# EAGLE design sparkpunk_sequencer (EAGLE 6.5.0)
PROD_ID: DIO-11895
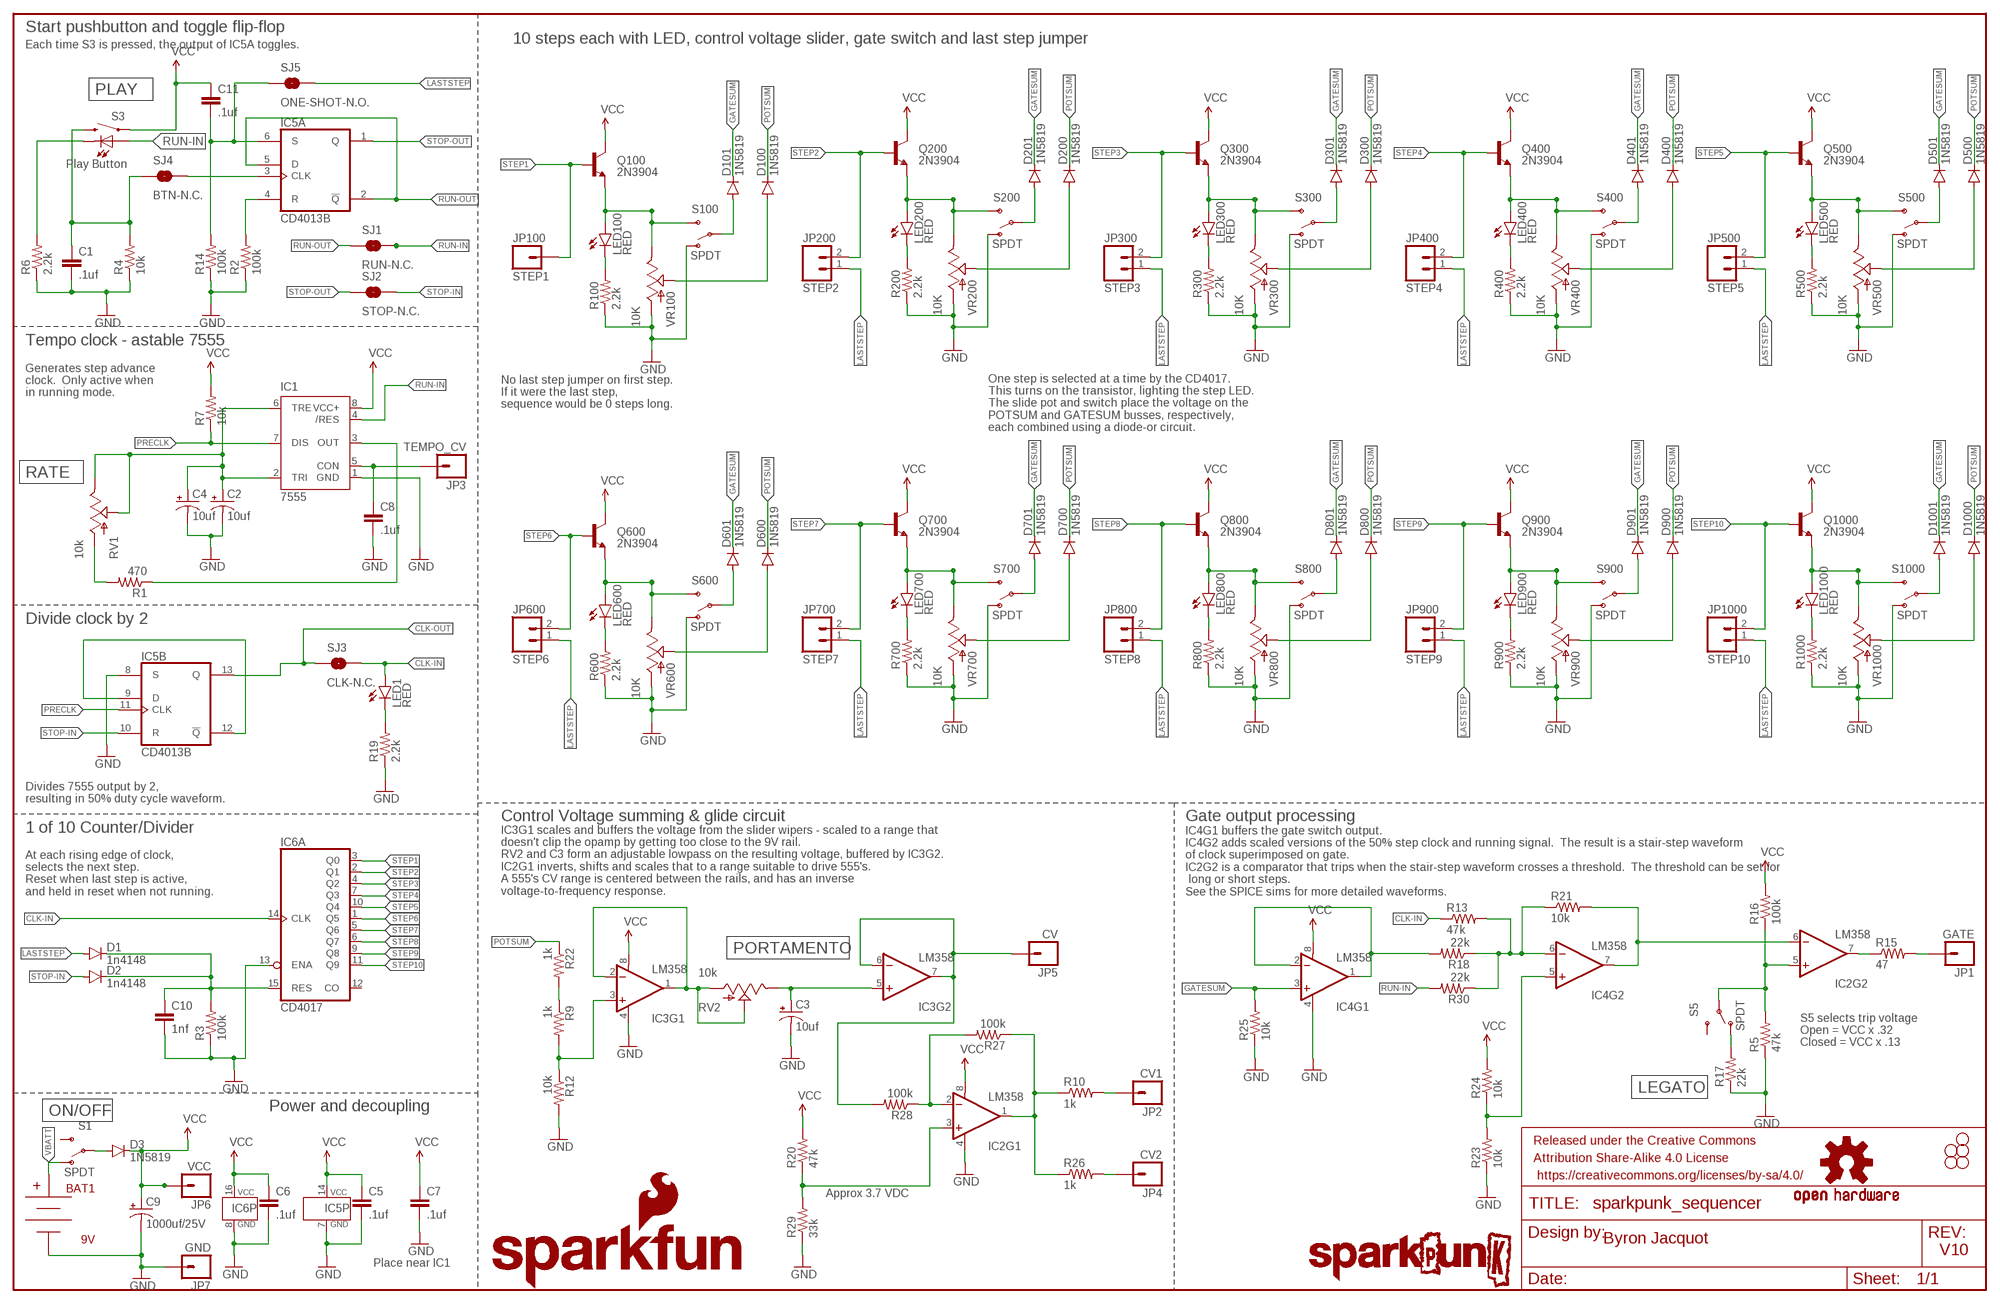
[diagram p0: schematic, sheet 1]

## Parts
BAT1  9V  BC9VPCKIT_SOLDERMASK  [BC9VPC_KIT]
C1  .1uf  0.1UF-50V-20%(PTH)KIT-EZ  [CAP-PTH-SMALL-KIT]
C2  10uf  10UF-25V-20%(PTH)KIT  [CPOL-RADIAL-10UF-25V-KIT]
C3  10uf  10UF-25V-20%(PTH)KIT  [CPOL-RADIAL-10UF-25V-KIT]
C4  10uf  10UF-25V-20%(PTH)KIT  [CPOL-RADIAL-10UF-25V-KIT]
C5  .1uf  0.1UF-50V-20%(PTH)KIT-EZ  [CAP-PTH-SMALL-KIT]
C6  .1uf  0.1UF-50V-20%(PTH)KIT-EZ  [CAP-PTH-SMALL-KIT]
C7  .1uf  0.1UF-50V-20%(PTH)KIT-EZ  [CAP-PTH-SMALL-KIT]
C8  .1uf  0.1UF-50V-20%(PTH)KIT-EZ  [CAP-PTH-SMALL-KIT]
C9  1000uf/25V  1000UF-25V(PTH)KIT  [CPOL-RADIAL-1000UF-25V-KIT]
C10  1nf  CAPKIT  [CAP-PTH-SMALL-KIT]
C11  .1uf  0.1UF-50V-20%(PTH)KIT-EZ  [CAP-PTH-SMALL-KIT]
D1  1n4148  DIODEKIT  [DIODE-1N4148-KIT]
D2  1n4148  DIODEKIT  [DIODE-1N4148-KIT]
D3  1N5819  DIODE  [DIODE-1N4001-KIT]
D100  1N5819  DIODE  [DIODE-1N4001-KIT]
D101  1N5819  DIODE  [DIODE-1N4001-KIT]
D200  1N5819  DIODE  [DIODE-1N4001-KIT]
D201  1N5819  DIODE  [DIODE-1N4001-KIT]
D300  1N5819  DIODE  [DIODE-1N4001-KIT]
D301  1N5819  DIODE  [DIODE-1N4001-KIT]
D400  1N5819  DIODE  [DIODE-1N4001-KIT]
D401  1N5819  DIODE  [DIODE-1N4001-KIT]
D500  1N5819  DIODE  [DIODE-1N4001-KIT]
D501  1N5819  DIODE  [DIODE-1N4001-KIT]
D600  1N5819  DIODE  [DIODE-1N4001-KIT]
D601  1N5819  DIODE  [DIODE-1N4001-KIT]
D700  1N5819  DIODE  [DIODE-1N4001-KIT]
D701  1N5819  DIODE  [DIODE-1N4001-KIT]
D800  1N5819  DIODE  [DIODE-1N4001-KIT]
D801  1N5819  DIODE  [DIODE-1N4001-KIT]
D900  1N5819  DIODE  [DIODE-1N4001-KIT]
D901  1N5819  DIODE  [DIODE-1N4001-KIT]
D1000  1N5819  DIODE  [DIODE-1N4001-KIT]
D1001  1N5819  DIODE  [DIODE-1N4001-KIT]
FRAME1  FRAME-LEDGER  [CREATIVE_COMMONS]
IC1  7555  NE555KIT  [DIP08-KIT]
IC2  LM358  LM358KIT  [DIP08-KIT]
IC3  LM358  LM358KIT  [DIP08-KIT]
IC4  LM358  LM358KIT  [DIP08-KIT]
IC5  CD4013B  CD4013  [DIL14-KIT]
IC6  CD4017  CD4017KIT  [DIL16-KIT]
JP1  GATE  M01SMDNS  [1X01NS]
JP2  CV1  M01SMDNS  [1X01NS]
JP3  TEMPO_CV  M01SMDNS  [1X01NS]
JP4  CV2  M01SMDNS  [1X01NS]
JP5  CV  M01SMDNS  [1X01NS]
JP6  VCC  M01SMDNS  [1X01NS]
JP7  GND  M01SMDNS  [1X01NS]
JP100  STEP1  M01SMDNS  [1X01NS]
JP200  STEP2  M021X02_NO_SILK  [1X02_NO_SILK]
JP300  STEP3  M021X02_NO_SILK  [1X02_NO_SILK]
JP400  STEP4  M021X02_NO_SILK  [1X02_NO_SILK]
JP500  STEP5  M021X02_NO_SILK  [1X02_NO_SILK]
JP600  STEP6  M021X02_NO_SILK  [1X02_NO_SILK]
JP700  STEP7  M021X02_NO_SILK  [1X02_NO_SILK]
JP800  STEP8  M021X02_NO_SILK  [1X02_NO_SILK]
JP900  STEP9  M021X02_NO_SILK  [1X02_NO_SILK]
JP1000  STEP10  M021X02_NO_SILK  [1X02_NO_SILK]
LED1  RED  LED5MM-KIT  [LED5MM-KIT]
LED100  RED  LED5MM-KIT  [LED5MM-KIT]
LED200  RED  LED5MM-KIT  [LED5MM-KIT]
LED300  RED  LED5MM-KIT  [LED5MM-KIT]
LED400  RED  LED5MM-KIT  [LED5MM-KIT]
LED500  RED  LED5MM-KIT  [LED5MM-KIT]
LED600  RED  LED5MM-KIT  [LED5MM-KIT]
LED700  RED  LED5MM-KIT  [LED5MM-KIT]
LED800  RED  LED5MM-KIT  [LED5MM-KIT]
LED900  RED  LED5MM-KIT  [LED5MM-KIT]
LED1000  RED  LED5MM-KIT  [LED5MM-KIT]
LOGO1  SPARKPUNK_LOGO.2_INCH_TALL  [SPARKPUNK_LOGO_.2]
LOGO2  OSHW-LOGOM  [OSHW-LOGO-M]
LOGO3  SPARKPUNK_LOGO.1INCH_TALL  [SPARKPUNK_LOGO_.1]
LOGO4  SFE_LOGO_NAME_FLAME.4_INCH  [SFE_LOGO_NAME_FLAME_.4]
Q100  2N3904  TRANSISTOR_NPNTO-92-AMMO  [TO-92-AMMO]
Q200  2N3904  TRANSISTOR_NPNTO-92-AMMO  [TO-92-AMMO]
Q300  2N3904  TRANSISTOR_NPNTO-92-AMMO  [TO-92-AMMO]
Q400  2N3904  TRANSISTOR_NPNTO-92-AMMO  [TO-92-AMMO]
Q500  2N3904  TRANSISTOR_NPNTO-92-AMMO  [TO-92-AMMO]
Q600  2N3904  TRANSISTOR_NPNTO-92-AMMO  [TO-92-AMMO]
Q700  2N3904  TRANSISTOR_NPNTO-92-AMMO  [TO-92-AMMO]
Q800  2N3904  TRANSISTOR_NPNTO-92-AMMO  [TO-92-AMMO]
Q900  2N3904  TRANSISTOR_NPNTO-92-AMMO  [TO-92-AMMO]
Q1000  2N3904  TRANSISTOR_NPNTO-92-AMMO  [TO-92-AMMO]
R1  470  RESISTOREZ  [AXIAL-0.3EZ]
R2  100k  RESISTOREZ  [AXIAL-0.3EZ]
R3  100k  RESISTOREZ  [AXIAL-0.3EZ]
R4  10k  RESISTOREZ  [AXIAL-0.3EZ]
R5  47k  RESISTOREZ  [AXIAL-0.3EZ]
R6  2.2k  RESISTOREZ  [AXIAL-0.3EZ]
R7  10k  RESISTOREZ  [AXIAL-0.3EZ]
R9  1k  RESISTOREZ  [AXIAL-0.3EZ]
R10  1k  RESISTOREZ  [AXIAL-0.3EZ]
R12  10k  RESISTOREZ  [AXIAL-0.3EZ]
R13  47k  RESISTOREZ  [AXIAL-0.3EZ]
R14  100k  RESISTOREZ  [AXIAL-0.3EZ]
R15  47  RESISTOREZ  [AXIAL-0.3EZ]
R16  100k  RESISTOREZ  [AXIAL-0.3EZ]
R17  22k  RESISTOREZ  [AXIAL-0.3EZ]
R18  22k  RESISTOREZ  [AXIAL-0.3EZ]
R19  2.2k  RESISTOREZ  [AXIAL-0.3EZ]
R20  47k  RESISTOREZ  [AXIAL-0.3EZ]
R21  10k  RESISTOREZ  [AXIAL-0.3EZ]
R22  1k  RESISTOREZ  [AXIAL-0.3EZ]
R23  10k  RESISTOREZ  [AXIAL-0.3EZ]
R24  10k  RESISTOREZ  [AXIAL-0.3EZ]
R25  10k  RESISTOREZ  [AXIAL-0.3EZ]
R26  1k  RESISTOREZ  [AXIAL-0.3EZ]
R27  100k  RESISTOREZ  [AXIAL-0.3EZ]
R28  100k  RESISTOREZ  [AXIAL-0.3EZ]
R29  33k  RESISTOREZ  [AXIAL-0.3EZ]
R30  22k  RESISTOREZ  [AXIAL-0.3EZ]
R100  2.2k  RESISTOREZ  [AXIAL-0.3EZ]
R200  2.2k  RESISTOREZ  [AXIAL-0.3EZ]
R300  2.2k  RESISTOREZ  [AXIAL-0.3EZ]
R400  2.2k  RESISTOREZ  [AXIAL-0.3EZ]
R500  2.2k  RESISTOREZ  [AXIAL-0.3EZ]
R600  2.2k  RESISTOREZ  [AXIAL-0.3EZ]
R700  2.2k  RESISTOREZ  [AXIAL-0.3EZ]
R800  2.2k  RESISTOREZ  [AXIAL-0.3EZ]
R900  2.2k  RESISTOREZ  [AXIAL-0.3EZ]
R1000  2.2k  RESISTOREZ  [AXIAL-0.3EZ]
RV1  10k  POTALPS-KIT  [ALPS_POT_KIT]
RV2  10k  POTALPS-KIT  [ALPS_POT_KIT]
S1  SPDT  SWITCH-SPDTKIT  [SWITCH-SPDT_KIT]
S3  Play Button  SWITCH-MOMENTARY-LEDEZ  [TACTILE-PTH-LED-12MM-EZ]
S5  SPDT  SWITCH-SPDTKIT  [SWITCH-SPDT_KIT]
S100  SPDT  SWITCH-SPDTKIT  [SWITCH-SPDT_KIT]
S200  SPDT  SWITCH-SPDTKIT  [SWITCH-SPDT_KIT]
S300  SPDT  SWITCH-SPDTKIT  [SWITCH-SPDT_KIT]
S400  SPDT  SWITCH-SPDTKIT  [SWITCH-SPDT_KIT]
S500  SPDT  SWITCH-SPDTKIT  [SWITCH-SPDT_KIT]
S600  SPDT  SWITCH-SPDTKIT  [SWITCH-SPDT_KIT]
S700  SPDT  SWITCH-SPDTKIT  [SWITCH-SPDT_KIT]
S800  SPDT  SWITCH-SPDTKIT  [SWITCH-SPDT_KIT]
S900  SPDT  SWITCH-SPDTKIT  [SWITCH-SPDT_KIT]
S1000  SPDT  SWITCH-SPDTKIT  [SWITCH-SPDT_KIT]
SJ1  RUN-N.C.  SOLDERJUMPERTRACE-PTH  [SJ_2S-TRACE-PTH]
SJ2  STOP-N.C.  SOLDERJUMPERTRACE-PTH  [SJ_2S-TRACE-PTH]
SJ3  CLK-N.C.  SOLDERJUMPERTRACE-PTH  [SJ_2S-TRACE-PTH]
SJ4  BTN-N.C.  SOLDERJUMPERTRACE-PTH  [SJ_2S-TRACE-PTH]
SJ5  ONE-SHOT-N.O.  SOLDERJUMPERPTH  [SJ_2S-PTH]
STANDOFF1  STAND-OFF  [STAND-OFF]
STANDOFF2  STAND-OFF  [STAND-OFF]
STANDOFF3  STAND-OFF  [STAND-OFF]
STANDOFF5  STAND-OFF  [STAND-OFF]
STANDOFF6  STAND-OFF  [STAND-OFF]
VR100  10K  SLIDER30MM-KIT  [SLIDER-MEDIUM-KIT]
VR200  10K  SLIDER30MM-KIT  [SLIDER-MEDIUM-KIT]
VR300  10K  SLIDER30MM-KIT  [SLIDER-MEDIUM-KIT]
VR400  10K  SLIDER30MM-KIT  [SLIDER-MEDIUM-KIT]
VR500  10K  SLIDER30MM-KIT  [SLIDER-MEDIUM-KIT]
VR600  10K  SLIDER30MM-KIT  [SLIDER-MEDIUM-KIT]
VR700  10K  SLIDER30MM-KIT  [SLIDER-MEDIUM-KIT]
VR800  10K  SLIDER30MM-KIT  [SLIDER-MEDIUM-KIT]
VR900  10K  SLIDER30MM-KIT  [SLIDER-MEDIUM-KIT]
VR1000  10K  SLIDER30MM-KIT  [SLIDER-MEDIUM-KIT]

## Nets
555OUT: IC1.3(OUT) R1.P$1
BTN-OUT: C1.1 R4.P$2 S3.2 SJ4.1
CLK-IN: IC6.14(A:CLK) LED1.A R13.P$1 SJ3.2
CLK-OUT: IC5.13(B:Q) SJ3.1
GATESUM: D101.C D201.C D301.C D401.C D501.C D601.C D701.C D801.C D901.C D1001.C IC4.3(+IN) R25.P$2
GND: BAT1.V- C1.2 C2.2(-) C3.2(-) C4.2(-) C5.2 C6.2 C7.2 C8.2 C9.- C10.2 IC1.1(GND) IC2.4(V-) IC3.4(V-) IC4.4(V-) IC5.7(P:GND) IC5.8(B:S) IC6.8(P:GND) IC6.13(A:ENA) JP7.1 R2.P$1 R3.P$1 R4.P$1 R5.P$1 R6.P$1 R12.P$2 R14.P$1 R17.P$1 R19.P$1 R23.P$1 R25.P$1 R29.P$1 R100.P$1 R200.P$1 R300.P$1 R400.P$1 R500.P$1 R600.P$1 R700.P$1 R800.P$1 R900.P$1 R1000.P$1 S100.1(O) S200.1(O) S300.1(O) S400.1(O) S500.1(O) S600.1(O) S700.1(O) S800.1(O) S900.1(O) S1000.1(O) VR100.BOTTOM(A) VR200.BOTTOM(A) VR300.BOTTOM(A) VR400.BOTTOM(A) VR500.BOTTOM(A) VR600.BOTTOM(A) VR700.BOTTOM(A) VR800.BOTTOM(A) VR900.BOTTOM(A) VR1000.BOTTOM(A)
LASTSTEP: D1.A JP200.1 JP300.1 JP400.1 JP500.1 JP600.1 JP700.1 JP800.1 JP900.1 JP1000.1 SJ5.2
N$1: LED100.A Q100.1(E) S100.3(S) VR100.TOP(E)
N$2: LED100.K(C) R100.P$2
N$3: D101.A S100.2(P)
N$4: D100.A VR100.WIPER(S)
N$5: R1.P$2 RV1.P$3(A)
N$6: IC3.1(OUT) IC3.2(-IN) RV2.P$2(S) RV2.P$3(A)
N$7: C8.1 IC1.5(CON) JP3.1
N$8: R6.P$2 S3.C
N$9: IC5.4(A:R) R2.P$2
N$10: C2.1(+) C4.1(+) IC1.2(TRI) IC1.6(TRE) RV1.P$1(E) RV1.P$2(S)
N$11: IC4.1(OUT) IC4.2(-IN) R18.P$2
N$13: LED1.K(C) R19.P$2
N$14: C10.1 D1.C D2.C IC6.15(A:RES) R3.P$2
N$15: IC3.3(+IN) R9.P$2 R12.P$1
N$16: R9.P$1 R22.P$2
N$17: IC2.2(-IN) R27.P$2 R28.P$1
N$18: C3.1(+) IC3.5(+IN) RV2.P$1(E)
N$19: IC2.3(+IN) R20.P$1 R29.P$2
N$20: JP1.1 R15.P$2
N$21: IC5.3(A:CLK) SJ4.2
N$22: IC2.5(+IN) R5.P$2 R16.P$1 S5.2(P)
N$23: IC2.7(OUT) R15.P$1
N$25: R17.P$2 S5.1(O)
N$26: IC5.9(B:D) IC5.12(B:!Q)
N$27: LED200.A Q200.1(E) S200.3(S) VR200.TOP(E)
N$28: LED200.K(C) R200.P$2
N$29: D200.A VR200.WIPER(S)
N$30: D201.A S200.2(P)
N$31: LED300.A Q300.1(E) S300.3(S) VR300.TOP(E)
N$32: LED300.K(C) R300.P$2
N$33: D300.A VR300.WIPER(S)
N$34: D301.A S300.2(P)
N$35: LED400.A Q400.1(E) S400.3(S) VR400.TOP(E)
N$36: LED400.K(C) R400.P$2
N$37: D400.A VR400.WIPER(S)
N$38: D401.A S400.2(P)
N$39: LED500.A Q500.1(E) S500.3(S) VR500.TOP(E)
N$40: LED500.K(C) R500.P$2
N$41: D500.A VR500.WIPER(S)
N$42: D501.A S500.2(P)
N$43: LED600.A Q600.1(E) S600.3(S) VR600.TOP(E)
N$44: LED600.K(C) R600.P$2
N$45: D600.A VR600.WIPER(S)
N$46: D601.A S600.2(P)
N$47: LED700.A Q700.1(E) S700.3(S) VR700.TOP(E)
N$48: LED700.K(C) R700.P$2
N$49: D700.A VR700.WIPER(S)
N$50: D701.A S700.2(P)
N$51: LED800.A Q800.1(E) S800.3(S) VR800.TOP(E)
N$52: LED800.K(C) R800.P$2
N$53: D800.A VR800.WIPER(S)
N$54: D801.A S800.2(P)
N$55: LED900.A Q900.1(E) S900.3(S) VR900.TOP(E)
N$56: LED900.K(C) R900.P$2
N$57: D900.A VR900.WIPER(S)
N$58: D901.A S900.2(P)
N$59: LED1000.A Q1000.1(E) S1000.3(S) VR1000.TOP(E)
N$60: LED1000.K(C) R1000.P$2
N$61: D1000.A VR1000.WIPER(S)
N$62: D1001.A S1000.2(P)
N$63: C11.2 IC5.6(A:S) R14.P$2 SJ5.1
N$64: IC4.6(-IN) R13.P$2 R18.P$1 R21.P$1 R30.P$1
N$65: IC3.6(-IN) IC3.7(OUT) JP5.1 R28.P$2
N$66: IC2.1(OUT) R10.P$1 R26.P$1 R27.P$1
N$67: JP4.1 R26.P$2
N$68: JP2.1 R10.P$2
N$69: IC2.6(-IN) IC4.7(OUT) R21.P$2
N$70: IC4.5(+IN) R23.P$2 R24.P$1
N$71: D3.A S1.2(P)
POTSUM: D100.C D200.C D300.C D400.C D500.C D600.C D700.C D800.C D900.C D1000.C R22.P$1
PRECLK: IC1.7(DIS) IC5.11(B:CLK) R7.P$1
RUN-IN: IC1.4(/RES) R30.P$2 S3.A SJ1.2
RUN-OUT: IC5.2(A:!Q) IC5.5(A:D) SJ1.1
STEP1: IC6.3(A:Q0) JP100.1 Q100.2(B)
STEP2: IC6.2(A:Q1) JP200.2 Q200.2(B)
STEP3: IC6.4(A:Q2) JP300.2 Q300.2(B)
STEP4: IC6.7(A:Q3) JP400.2 Q400.2(B)
STEP5: IC6.10(A:Q4) JP500.2 Q500.2(B)
STEP6: IC6.1(A:Q5) JP600.2 Q600.2(B)
STEP7: IC6.5(A:Q6) JP700.2 Q700.2(B)
STEP8: IC6.6(A:Q7) JP800.2 Q800.2(B)
STEP9: IC6.9(A:Q8) JP900.2 Q900.2(B)
STEP10: IC6.11(A:Q9) JP1000.2 Q1000.2(B)
STOP-IN: D2.A IC5.10(B:R) SJ2.2
STOP-OUT: IC5.1(A:Q) SJ2.1
VBATT: BAT1.V+ S1.1(O)
VCC: C5.1 C6.1 C7.1 C9.+ C11.1 D3.C IC1.8(VCC+) IC2.8(V+) IC3.8(V+) IC4.8(V+) IC5.14(P:VCC) IC6.16(P:VCC) JP6.1 Q100.3(C) Q200.3(C) Q300.3(C) Q400.3(C) Q500.3(C) Q600.3(C) Q700.3(C) Q800.3(C) Q900.3(C) Q1000.3(C) R7.P$2 R16.P$2 R20.P$2 R24.P$2 S3.4
Unconnected: IC6.12(A:CO) S1.3(S) S5.3(S)

## Notes on the sheet
- Start pushbutton and toggle flip-flop
- 10 steps each with LED, control voltage slider, gate switch and last step jumper
- Each time S3 is pressed, the output of IC5A toggles.
- PLAY
- Tempo clock - astable 7555
- Generates step advance 
  clock.  Only active when 
  in running mode.
- No last step jumper on first step.
  If it were the last step, 
  sequence would be 0 steps long.
- One step is selected at a time by the CD4017.
  This turns on the transistor, lighting the step LED.
  The slide pot and switch place the voltage on the
  POTSUM and GATESUM busses, respectively, 
  each combined using a diode-or circuit.
- RATE
- Divide clock by 2
- Divides 7555 output by 2, 
  resulting in 50% duty cycle waveform.
- Control Voltage summing & glide circuit | Gate output processing
- IC3G1 scales and buffers the voltage from the slider wipers - scaled to a range that 
  doesn't clip the opamp by getting too close to the 9V rail.
  RV2 and C3 form an adjustable lowpass on the resulting voltage, buffered by IC3G2.
  IC2G1 inverts, shifts and scales that to a range suitable to drive 555's.
  A 555's CV range is centered between the rails, and has an inverse 
  voltage-to-frequency response.
- 1 of 10 Counter/Divider
- At each rising edge of clock, 
  selects the next step.
  Reset when last step is active,
  and held in reset when not running.
- IC4G1 buffers the gate switch output.  
  IC4G2 adds scaled versions of the 50% step clock and running signal.  The result is a stair-step waveform 
  of clock superimposed on gate. 
  IC2G2 is a comparator that trips when the stair-step waveform crosses a threshold.  The threshold can be set for
   long or short steps.
  See the SPICE sims for more detailed waveforms.
- PORTAMENTO
- S5 selects trip voltage
  Open = VCC x .32
  Closed = VCC x .13
- LEGATO
- ON/OFF | Power and decoupling
- Approx 3.7 VDC
- Byron Jacquot
- V10
- Place near IC1

## Library data of the parts
BAT1 = SparkFun-Connectors:BC9VPC: 9V board-mount battery cradle; PROD_ID: BATT-10855
C1 C5-C8 C11 = SparkFun-Capacitors:0.1UF-50V-20%(PTH): CAP-08370; PROD_ID: CAP-08370
C2-C4 = SparkFun-Capacitors:10UF-25V-20%(PTH): CAP-08440; PROD_ID: CAP-08440
C9 = SparkFun-Capacitors:1000UF-25V(PTH): CAP-08070; PROD_ID: CAP-09538
C10 = SparkFun-Capacitors:CAP: Capacitor Standard 0603 ceramic capacitor, and 0.1" leaded capacitor.; PROD_ID: CAP-09182
D1 D2 = SparkFun-DiscreteSemi:DIODE: Diode These are standard reverse protection diodes and small signal diodes. SMA package can handle up to about 1A. SOD-323 can handle about 200mA. What the SOD-323 package when ordering, there are some mfgs out there that are 5-pin packages.; PROD_ID: DIO-08378
D3 D100 D101 D200 D201 D300 D301 D400 D401 D500 D501 D600 D601 D700 D701 D800 D801 D900 D901 D1000 D1001 = SparkFun-DiscreteSemi:DIODE: Diode These are standard reverse protection diodes and small signal diodes. SMA package can handle up to about 1A. SOD-323 can handle about 200mA. What the SOD-323 package when ordering, there are some mfgs out there that are 5-pin packages.; PROD_ID: DIO-11895
FRAME1 = SparkFun-Aesthetics:FRAME-LEDGER: Schematic Frame Standard 11x14 US Ledger frame
IC1 = SparkFun-AnalogIC:NE555: General purpose bipolar Timer; DIST: digikey; DIST_ID: ICM7555IPAZ-ND
IC2-IC4 = SparkFun-AnalogIC:LM358: Jellybean op-amp; PROD_ID: IC-09172
IC5 = SparkFun-DigitalIC:CD4013: Dual D-type Flip-Flop; PROD_ID: IC-11930
IC6 = SparkFun-DigitalIC:CD4017; DIST: Digikey; DIST_ID: 296-2037-5-ND
JP1-JP7 JP100 = SparkFun-Connectors:M01: Header 1 Standard 1-pin 0.1" header. Use with straight break away headers (SKU : PRT-00116), right angle break away headers (PRT-00553), swiss pins (PRT-00743), machine pins (PRT-00117), and female headers (PRT-00115).
JP200 JP300 JP400 JP500 JP600 JP700 JP800 JP900 JP1000 = SparkFun-Connectors:M02: Standard 2-pin 0.1" header. Use with - straight break away headers ( PRT-00116) - right angle break away headers (PRT-00553) - swiss pins (PRT-00743) - machine pins (PRT-00117) - female headers (PRT-00115) Molex polarized connector foot print use with: PRT-08233 with associated crimp pins and housings. 2.54_SCREWTERM for use with PRT-10571. 3.5mm Screw Terminal footprints for PRT-08084 5mm Screw Terminal footprints for use with PRT-08433
LED1 LED100 LED200 LED300 LED400 LED500 LED600 LED700 LED800 LED900 LED1000 = SparkFun-LED:LED: LEDs Standard schematic elements and footprints for 5mm, 3mm, 1206, and 0603 sized LEDs. 5mm - Spark Fun Electronics SKU : COM-00529 (and others); PROD_ID: DIO-09529
LOGO1 LOGO3 = SparkFun-Aesthetics:SPARKPUNK_LOGO
LOGO2 = SparkFun-Aesthetics:OSHW-LOGO: Open Source Hardware Logo This logo indicates the piece of hardware it is found on incorporates a OSHW license and/or adheres to the definition of open source hardware found here: http://freedomdefined.org/OSHW
LOGO4 = SparkFun-Aesthetics:SFE_LOGO_NAME_FLAME: SFE Logo, name and flame This is the SparkFun full logo. The logo on the schematic will always be the same size; the package variant is the height of the flame part of the logo. Default layer for the logo on the board is tSilk.
Q100 Q200 Q300 Q400 Q500 Q600 Q700 Q800 Q900 Q1000 = SparkFun-DiscreteSemi:TRANSISTOR_NPN: Generic NPN BJT MMBT2222A - TRANS-08049 (SOT-23, 1A 40V) MPSA42 - TRANS-09116 (SOT-23, 500mA 300V) MMBT5088LT1G - TRANS-11160 (SOT-23, 50 mA 30V) BC547 - COM-08928 <http://www.sparkfun.com/products/8928> (TO-92 45V 100mA) (1.Collector 2.Base 3.Emitter) 2N3904 - COM-00521 <http://www.sparkfun.com/products/521> (TO-92 40V 200mA) (1.Emitter 2.Base 3.Collector) P2N2222A - COM-12852 <http://www.sparkfun.com/products/12852> (TO-92 40V 600mA) (1.Collector 2.Base 3.Emitter); PROD_ID: TRANS-08447
R1 = SparkFun-Resistors:RESISTOR: Resistor Basic schematic elements and footprints for 0603, 1206, and PTH resistors.; PROD_ID: RES-10693
R2 R3 R14 R16 R27 R28 = SparkFun-Resistors:RESISTOR: Resistor Basic schematic elements and footprints for 0603, 1206, and PTH resistors.; PROD_ID: RES-10686
R4 R7 R12 R21 R23-R25 = SparkFun-Resistors:RESISTOR: Resistor Basic schematic elements and footprints for 0603, 1206, and PTH resistors.; PROD_ID: RES-09435
R5 R13 R20 R29 = SparkFun-Resistors:RESISTOR: Resistor Basic schematic elements and footprints for 0603, 1206, and PTH resistors.; PROD_ID: RES-10687
R6 R19 R100 R200 R300 R400 R500 R600 R700 R800 R900 R1000 = SparkFun-Resistors:RESISTOR: Resistor Basic schematic elements and footprints for 0603, 1206, and PTH resistors.; PROD_ID: RES-10691
R9 R10 R22 R26 = SparkFun-Resistors:RESISTOR: Resistor Basic schematic elements and footprints for 0603, 1206, and PTH resistors.; PROD_ID: RES-08380
R15 = SparkFun-Resistors:RESISTOR: Resistor Basic schematic elements and footprints for 0603, 1206, and PTH resistors.; PROD_ID: RES-10697
R17 R18 R30 = SparkFun-Resistors:RESISTOR: Resistor Basic schematic elements and footprints for 0603, 1206, and PTH resistors.; PROD_ID: RES-10688
RV1 RV2 = SparkFun-Electromechanical:POT; PROD_ID: RES-09177
S1 S5 S100 S200 S300 S400 S500 S600 S700 S800 S900 S1000 = SparkFun-Electromechanical:SWITCH-SPDT: SPDT Switch Simple slide switch, Spark Fun Electronics SKU : COM-00102 DPDT SMT slide switch, AYZ0202, SWCH-08179; PROD_ID: SWCH-08261
S3 = SparkFun-Electromechanical:SWITCH-MOMENTARY-LED: EZ is for Kits. There is no tStop (covering up the top side of the pads with mask). This helps the beginner see which side they should be soldering too.; PROD_ID: SWCH-11758
SJ1-SJ5 = SparkFun-Passives:SOLDERJUMPER: Solder Jumper Standard SMD solder jumper. Used to automate production. Two varients : Normally Open and Normally Closed are the same, but have different paste layers. NC will have a large amount of paste and should jumper during reflow.
STANDOFF1-STANDOFF3 STANDOFF5 STANDOFF6 = SparkFun-Electromechanical:STAND-OFF: #4 Stand Off This is the mechanical footprint for a #4 phillips button head screw. Use the keepout ring to avoid running the screw head into surrounding components. SKU : PRT-00447
VR100 VR200 VR300 VR400 VR500 VR600 VR700 VR800 VR900 VR1000 = SparkFun-Electromechanical:SLIDER: Slide-type potentiometers. Small and meduim footprints untested.; PROD_ID: RES-11931

## Board
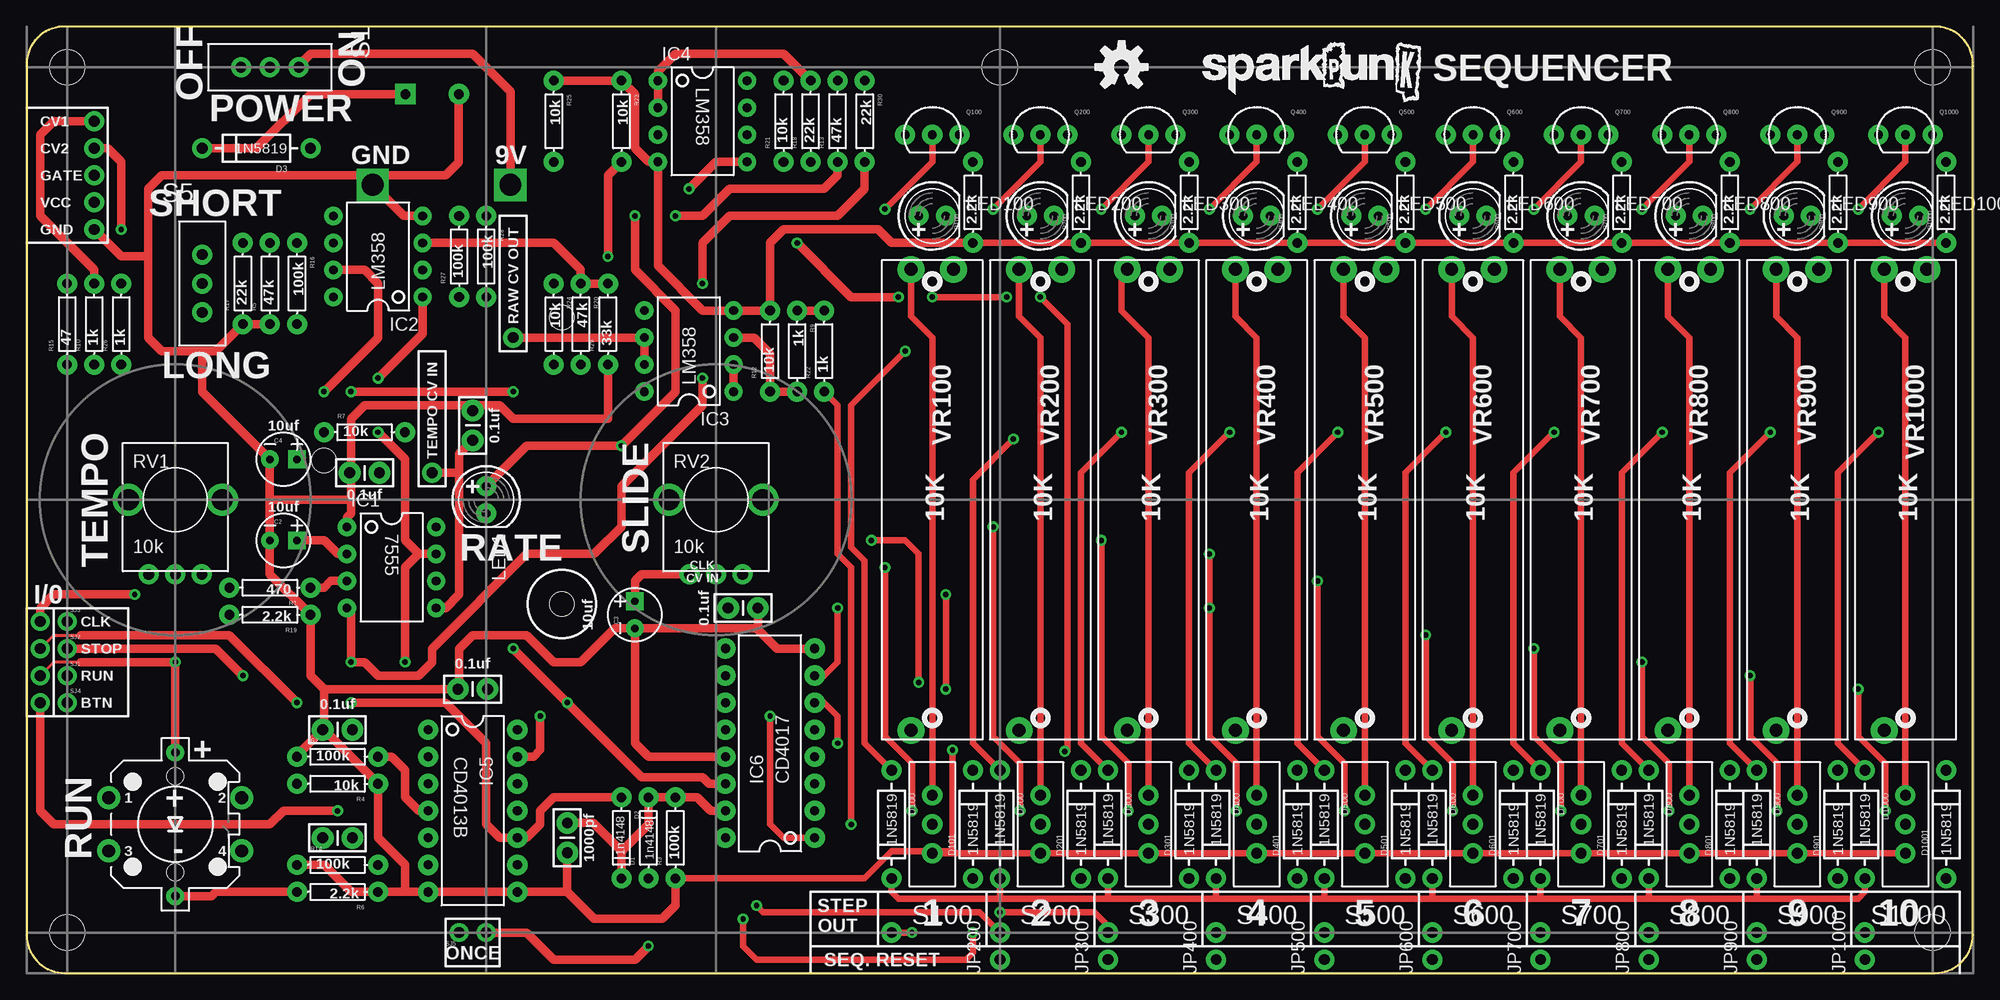
[diagram p1: board, top side]
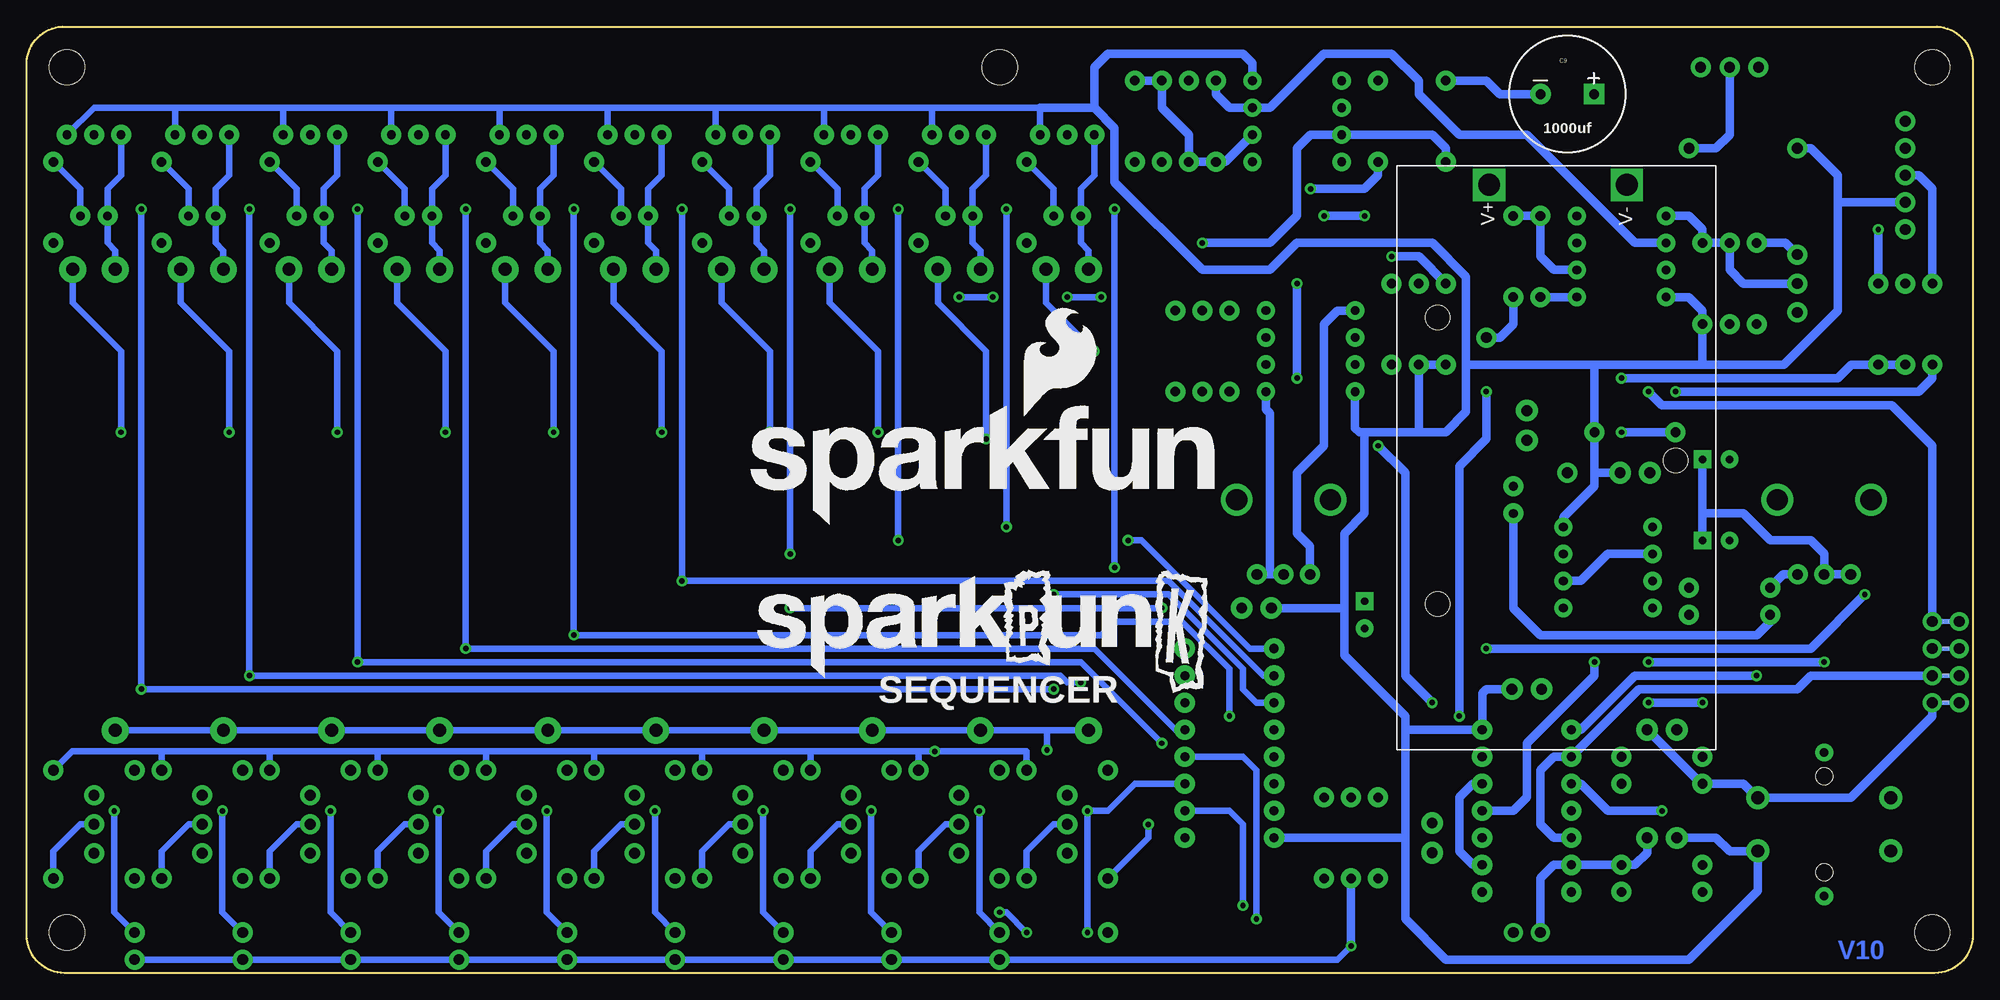
[diagram p2: board, bottom side, seen from below]

Size 182.86 x 88.9 mm. Coordinates in mm from the lower left corner, seen from the top.
Outline: 3.59,0 179.28,0 arc90 182.86,3.58 182.86,85.22 arc90 179.51,88.9 3.37,88.9 arc90 0,85.2 0,3.59 arc90 3.59,0
Copper layers (1*16): Top 0.035mm / dielectric 1.5mm / Bottom 0.035mm
Design rules "SparkFun-2-layer *": minimum track width 7mil, minimum drill 15mil, track to track 8mil, track to pad 8mil, pad to pad 8mil, via to via 8mil, smd to smd 8mil, copper to edge 8mil, drill to drill 8mil, minimum pad ring 12mil, minimum via ring 10mil, stop-mask expansion 4mil, vias tented up to drill 20mil, thermal gap 10mil

### Footprints (pad centres in the part's own frame; a part is rotated, then mirrored left to right if it is on the bottom)
BC9VPC_KIT = drill 2.032 square: V+ 53.086,21.336; V- 53.086,8.382 | hole 2.286: 27.178,3.81; 13.716,26.162; 40.64,26.162
CAP-PTH-SMALL-KIT = drill 1.016 pad 2.032: 1 -1.397,0; 2 1.397,0
CPOL-RADIAL-10UF-25V-KIT = drill 0.7 pad 1.651 square: 1 1.27,0 | drill 0.7 pad 1.651: 2 -1.27,0
CPOL-RADIAL-1000UF-25V-KIT = drill 0.9 pad 1.93 square: + 2.5,0 | drill 0.9 pad 1.93: - -2.5,0
DIODE-1N4148-KIT = drill 0.9 pad 1.88: A -3.81,0; C 3.81,0
DIODE-1N4001-KIT = drill 1.016 pad 1.88: A -5.08,0; C 5.08,0
DIP08-KIT = drill 0.813 pad 1.727: 1 -3.81,-4.191; 2 -1.27,-4.191; 3 1.27,-4.191; 4 3.81,-4.191; 5 3.81,4.191; 6 1.27,4.191; 7 -1.27,4.191; 8 -3.81,4.191
DIL14-KIT = drill 0.864 pad 1.905: 1 -8.89,-4.191; 2 -6.35,-4.191; 3 -3.81,-4.191; 4 -1.27,-4.191; 5 1.27,-4.191; 6 3.81,-4.191; 7 6.35,-4.191; 8 6.35,4.191; 9 3.81,4.191; 10 1.27,4.191; 11 -1.27,4.191; 12 -3.81,4.191; 13 -6.35,4.191; 14 -8.89,4.191
DIL16-KIT = drill 0.864 pad 1.905: 1 -8.89,-4.191; 2 -6.35,-4.191; 3 -3.81,-4.191; 4 -1.27,-4.191; 5 1.27,-4.191; 6 3.81,-4.191; 7 6.35,-4.191; 8 8.89,-4.191; 9 8.89,4.191; 10 6.35,4.191; 11 3.81,4.191; 12 1.27,4.191; 13 -1.27,4.191; 14 -3.81,4.191; 15 -6.35,4.191; 16 -8.89,4.191
1X01NS = drill 1.016 pad 1.88: 1 0,0
1X02_NO_SILK = drill 1.016 pad 1.88: 1 0,0; 2 2.54,0
LED5MM-KIT = drill 0.813 pad 1.88: A -1.27,0; K 1.27,0
TO-92-AMMO = drill 0.813 pad 1.88: 1 -2.54,0; 2 0,0; 3 2.54,0
AXIAL-0.3EZ = drill 0.9 pad 1.88: P$1 -3.81,0; P$2 3.81,0
ALPS_POT_KIT = drill 1 pad 1.88: P$1 7,-2.5; P$2 7,0; P$3 7,2.5 | drill 2: P$4 0,-4.4; P$5 0,4.4
SWITCH-SPDT_KIT = drill 1.016 pad 1.88: 1 0,2.718; 2 0,0; 3 0,-2.718
TACTILE-PTH-LED-12MM-EZ = drill 1.2 pad 2.159: 1 -6.25,2.5; 2 6.25,2.5; 3 -6.25,-2.5; 4 6.25,-2.5 | drill 0.8 pad 1.676: A 0,6.75; C 0,-6.75 | hole 1.6: 0,4.5; 0,-4.5
SJ_2S-TRACE-PTH = drill 1.016 pad 1.778: 1 -1.27,0; 2 1.27,0 | smd 1.27 x 0.381 bottom: P$1 0,0
SJ_2S-PTH = drill 1.016 pad 1.778: 1 -1.27,0; 2 1.27,0
STAND-OFF = hole 3.302: 0,0
SLIDER-MEDIUM-KIT = drill 1.2 pad 2.5: BOTTOM 21.65,-2; TOP -21.65,-2; WIPER -21.65,2

### Placement (x,y rotation side)
BAT1  24.13,20.95 90 bottom
C1  29.21,22.86 180 top
C2  24.13,40.64 0 top
C3  57.15,33.66 90 top
C4  24.13,48.26 0 top
C5  41.91,26.67 180 top
C6  67.31,34.29 0 top
C7  31.75,46.99 180 top
C8  41.91,51.44 90 top
C9  38.1,82.55 0 bottom
C10  50.8,12.7 270 top
C11  29.21,12.7 0 top
D1  58.42,12.7 90 top
D2  55.88,12.7 270 top
D3  21.59,77.47 180 top
D100  81.28,13.97 270 top
D101  88.9,13.97 90 top
D200  91.44,13.97 270 top
D201  99.06,13.97 90 top
D300  101.6,13.97 270 top
D301  109.22,13.97 90 top
D400  111.76,13.97 270 top
D401  119.38,13.97 90 top
D500  121.92,13.97 270 top
D501  129.54,13.97 90 top
D600  132.08,13.97 270 top
D601  139.7,13.97 90 top
D700  142.24,13.97 270 top
D701  149.86,13.97 90 top
D800  152.4,13.97 270 top
D801  160.02,13.97 90 top
D900  162.56,13.97 270 top
D901  170.18,13.97 90 top
D1000  172.72,13.97 270 top
D1001  180.34,13.97 90 top
FRAME1  22.86,-10.16 0 top  (outside the outline)
IC1  34.29,38.1 270 top
IC2  33.02,67.31 90 top
IC3  62.23,58.42 90 top
IC4  63.5,80.01 270 top
IC5  41.91,13.97 270 top
IC6  69.85,21.59 90 top
JP1  6.35,74.93 0 top
JP2  6.35,80.01 0 top
JP3  38.1,46.99 0 top
JP4  6.35,77.47 90 top
JP5  45.72,59.69 90 top
JP6  6.35,72.39 0 top
JP7  6.35,69.85 0 top
JP100  81.28,3.81 0 top
JP200  91.44,1.27 90 top
JP300  101.6,1.27 90 top
JP400  111.76,1.27 90 top
JP500  121.92,1.27 90 top
JP600  132.08,1.27 90 top
JP700  142.24,1.27 90 top
JP800  152.4,1.27 90 top
JP900  162.56,1.27 90 top
JP1000  172.72,1.27 90 top
LED1  43.18,44.45 270 top
LED100  85.09,71.12 0 top
LED200  95.25,71.12 0 top
LED300  105.41,71.12 0 top
LED400  115.57,71.12 0 top
LED500  125.73,71.12 0 top
LED600  135.89,71.12 0 top
LED700  146.05,71.12 0 top
LED800  156.21,71.12 0 top
LED900  166.37,71.12 0 top
LED1000  176.53,71.12 0 top
LOGO1  114.3,30.48 0 bottom
LOGO2  102.87,85.09 0 top
LOGO3  110.49,83.82 0 top
LOGO4  115.57,41.91 0 bottom
Q100  85.09,78.74 0 top
Q200  95.25,78.74 0 top
Q300  105.41,78.74 0 top
Q400  115.57,78.74 0 top
Q500  125.73,78.74 0 top
Q600  135.89,78.74 0 top
Q700  146.05,78.74 0 top
Q800  156.21,78.74 0 top
Q900  166.37,78.74 0 top
Q1000  176.53,78.74 0 top
R1  22.86,36.2 180 top
R2  29.21,20.32 0 top
R3  60.96,12.7 90 top
R4  29.21,17.78 180 top
R5  22.86,64.77 90 top
R6  29.21,7.62 180 top
R7  31.75,50.8 0 top
R9  72.39,58.42 270 top
R10  6.35,60.96 90 top
R12  69.85,58.42 90 top
R13  76.2,80.01 90 top
R14  29.21,10.16 0 top
R15  3.81,60.96 90 top
R16  25.4,64.77 270 top
R17  20.32,64.77 90 top
R18  73.66,80.01 90 top
R19  22.86,33.66 180 top
R20  52.07,60.96 270 top
R21  71.12,80.01 90 top
R22  74.93,58.42 90 top
R23  55.88,80.01 270 top
R24  49.53,60.96 270 top
R25  49.53,80.01 270 top
R26  8.89,60.96 90 top
R27  40.64,67.31 90 top
R28  43.18,67.31 270 top
R29  54.61,60.96 90 top
R30  78.74,80.01 270 top
R100  88.9,72.39 90 top
R200  99.06,72.39 90 top
R300  109.22,72.39 90 top
R400  119.38,72.39 90 top
R500  129.54,72.39 90 top
R600  139.7,72.39 90 top
R700  149.86,72.39 90 top
R800  160.02,72.39 90 top
R900  170.18,72.39 90 top
R1000  180.34,72.39 90 top
RV1  13.97,44.45 270 top
RV2  64.77,44.45 270 top
S1  22.86,85.09 270 top
S3  13.97,13.97 0 top
S5  16.51,64.77 0 top
S100  85.09,13.97 180 top
S200  95.25,13.97 180 top
S300  105.41,13.97 180 top
S400  115.57,13.97 180 top
S500  125.73,13.97 180 top
S600  135.89,13.97 180 top
S700  146.05,13.97 180 top
S800  156.21,13.97 180 top
S900  166.37,13.97 180 top
S1000  176.53,13.97 180 top
SJ1  2.54,27.94 180 top
SJ2  2.54,30.48 180 top
SJ3  2.54,33.02 180 top
SJ4  2.54,25.4 180 top
SJ5  41.91,3.81 0 top
STANDOFF1  3.81,3.81 0 top
STANDOFF2  3.81,85.09 0 top
STANDOFF3  91.44,85.09 0 top
STANDOFF5  179.07,3.81 0 top
STANDOFF6  179.07,85.09 0 top
VR100  85.09,44.45 270 top
VR200  95.25,44.45 270 top
VR300  105.41,44.45 270 top
VR400  115.57,44.45 270 top
VR500  125.73,44.45 270 top
VR600  135.89,44.45 270 top
VR700  146.05,44.45 270 top
VR800  156.21,44.45 270 top
VR900  166.37,44.45 270 top
VR1000  176.53,44.45 270 top

### Tracks (layer width: path | path; a pad name or v marks a point on that pad's centre or on a via)
555OUT
  Top 0.813: R1.P$1 27.94,36.2 28.58,36.83 IC1.3
BTN-OUT
  Bottom 0.813: C1.1 25.53,17.78 R4.P$2 21.59,17.78 20.28,16.47 S3.2 11.47,16.47 3.81,24.13 SJ4.1
CLK-IN  (via drill 0.51)
  Top 0.813: IC6.14 64.14,17.78 63.5,18.41 57.79,18.41 v50.8,25.4 v45.72,30.48 | SJ3.2 1.27,34.29 2.54,35.56 v10.16,35.56 | v57.15,71.12 57.15,66.04 60.96,62.23 60.96,54.61 v55.88,49.53 46.99,49.53 LED1.A | R13.P$1 76.2,74.93 74.93,73.66 66.04,73.66 63.5,71.12 v60.96,71.12
  Bottom 0.813: v45.72,30.48 15.24,30.48 v10.16,35.56 | v50.8,25.4 53.34,27.94 53.34,46.99 v55.88,49.53 | v57.15,71.12 v60.96,71.12
CLK-OUT  (via drill 0.51)
  Top 0.813: v30.48,54.61 v45.72,54.61 | v48.26,24.13 48.26,20.95 47.63,20.32 IC5.13
  Bottom 0.813: v45.72,54.61 45.72,50.16 48.26,47.62 v48.26,24.13 | SJ3.1 3.81,49.53 7.62,53.34 29.21,53.34 v30.48,54.61
GATESUM  (via drill 0.51)
  Top 0.61: v95.25,63.5 97.79,60.96 97.79,20.83 v97.54,20.83 | v92.08,63.5 v85.09,63.5
  Top 0.813: v72.39,68.58 77.47,63.5 v81.92,63.5
  Bottom 0.61: D1001.C 178.56,20.83 170.18,20.83 | 170.18,20.83 160.02,20.83 | 160.02,20.83 149.86,20.83 | 149.86,20.83 139.7,20.83 | 139.7,20.83 129.54,20.83 | 129.54,20.83 119.38,20.83 | 119.38,20.83 109.22,20.83 | 109.22,20.83 99.06,20.83 | 99.06,20.83 v97.54,20.83 88.9,20.83 D101.C | D901.C 170.18,20.83 | D801.C 160.02,20.83 | D701.C 149.86,20.83 | D601.C 139.7,20.83 | D201.C 99.06,20.83 | D301.C 109.22,20.83 | D401.C 119.38,20.83 | D501.C 129.54,20.83 | v95.25,63.5 v92.08,63.5 | v81.92,63.5 v85.09,63.5
  Bottom 0.813: R25.P$2 49.53,77.47 50.8,78.74 IC4.3 62.23,78.74 63.5,77.47 63.5,71.12 66.04,68.58 v72.39,68.58
GND  (via drill 0.51)
  Top 0.61: S1000.1 S900.1 S800.1 S700.1 S600.1 S500.1 S400.1 S300.1 S200.1 87,11.25 | 87,11.25 S100.1 | R100.P$1 R200.P$1 R300.P$1 R400.P$1 R500.P$1 R600.P$1 R700.P$1 R800.P$1 R900.P$1 R1000.P$1 | 87,11.43 87,11.25 | v87,20.95 87,11.43 | 87,11.43 81.28,11.43 78.74,8.89 R3.P$1
  Top 0.813: R25.P$1 R23.P$1 57.15,82.55 57.15,77.47 58.42,76.2 IC4.4 59.31,66.42 63.5,62.23 IC3.4 R12.P$2 69.85,68.58 71.12,69.85 80.01,69.85 81.28,68.58 R100.P$1 | R5.P$1 R17.P$1 17.78,58.42 16.51,58.42 | 16.51,58.42 12.7,58.42 11.43,59.69 11.43,67.31 | 11.43,67.31 11.43,73.66 12.7,74.93 31.62,74.93 BAT1.V- | 22.86,44.45 C4.2 16.51,54.61 16.51,58.42 | IC1.1 30.1,42.8 30.48,43.18 30.48,44.45 | C7.2 30.48,46.86 | 30.48,46.86 30.48,44.45 | 30.48,46.86 30.48,52.07 31.75,53.34 41.91,53.34 | C8.2 41.91,53.34 | 22.86,44.45 C2.2 22.86,37.47 R19.P$1 26.67,27.94 27.94,26.67 | 22.86,44.45 30.48,44.45 | C1.2 27.94,22.99 27.94,26.67 | C1.2 25.4,20.45 R2.P$1 | C1.2 27.94,22.86 R4.P$1 33.02,12.7 35.56,10.16 35.56,7.62 | 27.94,26.67 C5.2 40.64,26.8 40.64,30.48 41.91,31.75 46.99,31.75 49.53,29.21 52.07,29.21 55.25,32.38 C3.2 | R14.P$1 27.94,10.16 30.48,7.62 R6.P$1 35.56,7.62 | IC2.4 35.43,71.12 BAT1.V- | R29.P$1 54.61,52.07 45.72,52.07 44.45,53.34 41.91,53.34 | 50.8,7.62 IC5.8 IC5.7 35.56,7.62 | C10.2 50.8,7.62 | 50.8,7.62 53.34,5.08 59.69,5.08 60.96,6.35 R3.P$1 | IC6.13 58.42,20.32 57.15,21.59 C3.2 | 68.58,32.38 C3.2 | IC6.8 70.49,30.48 68.58,32.38 | C6.2 68.71,32.51 68.58,32.38 | JP7.1 8.89,67.31 11.43,67.31 | C9.- 40.6,76.16 39.37,74.93 33.4,74.93 BAT1.V-
  Bottom 0.61: VR1000.BOTTOM VR900.BOTTOM VR800.BOTTOM VR700.BOTTOM VR600.BOTTOM VR500.BOTTOM VR400.BOTTOM VR300.BOTTOM VR200.BOTTOM 87,22.8 | 87,22.8 VR100.BOTTOM | v87,20.95 87,22.8
  Bottom 0.813: C9.- 44.45,82.55 45.72,83.82 R25.P$1
LASTSTEP  (via drill 0.51)
  Top 0.813: SJ5.2 46.99,3.81 49.53,1.27 57.15,1.27 v58.42,2.54
  Bottom 0.61: JP1000.1 JP900.1 JP800.1 JP700.1 JP600.1 JP500.1 JP400.1 JP300.1 JP200.1 59.69,1.27 v58.42,2.54
  Bottom 0.813: D1.A v58.42,2.54
N$1
  Top 0.61: S100.3 85.09,59.69 83.09,61.69 VR100.TOP
  Bottom 0.61: Q100.1 82.55,74.93 83.82,73.66 LED100.A 83.82,68.58 83.09,67.85 VR100.TOP
N$2
  Bottom 0.61: LED100.K 86.36,73.66 R100.P$2
N$3
  Bottom 0.61: S100.2 86.36,13.97 88.9,11.43 D101.A
N$4  (via drill 0.51)
  Top 0.61: D100.A 78.74,21.59 78.74,38.73 77.47,40.01 77.47,53.34 v82.55,58.42
  Bottom 0.61: v82.55,58.42 87.09,62.96 VR100.WIPER
N$5
  Bottom 0.813: RV1.P$3 17.8,37.45 R1.P$2
N$6
  Top 0.813: IC3.2 IC3.1
  Bottom 0.813: IC3.1 66.42,52.96 66.04,52.58 66.04,37.49 66.08,37.45 RV2.P$3 RV2.P$2
N$7
  Top 0.813: IC1.5 39.37,34.29 40.64,35.56 40.64,46.99 | JP3.1 40.64,46.99 | 40.64,46.99 40.64,48.77 C8.1
N$8
  Top 0.813: S3.C 17.38,7.22 17.78,7.62 R6.P$2
N$9
  Top 0.813: R2.P$2 34.29,20.32 35.56,19.05 35.56,16.51 36.83,15.24 IC5.4
N$10
  Top 0.813: IC1.2 29.21,39.37 27.94,40.64 C2.1
  Bottom 0.813: C2.1 25.4,43.18 | 25.4,43.18 C4.1 | RV1.P$1 RV1.P$2 13.97,39.37 15.24,40.64 19.05,40.64 21.59,43.18 25.4,43.18 | IC1.6 36.83,36.83 34.29,39.37 IC1.2
N$11
  Top 0.813: IC4.2 IC4.1 59.31,84.71 60.96,86.36 71.12,86.36 R18.P$2
N$13
  Bottom 0.813: R19.P$2 19.05,33.02 20.32,31.75 40.64,31.75 43.18,34.29 LED1.K
N$14
  Top 0.813: IC6.15 64.26,15.24 62.99,16.51 R3.P$2 D1.C 58.42,13.97 55.88,11.43 | 55.88,11.43 D2.C | C10.1 53.21,14.1 55.88,11.43
N$15
  Top 0.813: R9.P$2 R12.P$1 69.85,58.17 68.33,59.69 IC3.3
N$16
  Top 0.813: R22.P$2 R9.P$1
N$17
  Bottom 0.813: IC2.2 39.37,66.04 40.64,67.31 R27.P$2 R28.P$1
N$18
  Top 0.813: C3.1 57.15,36.83 57.77,37.45 RV2.P$1
  Bottom 0.813: IC3.5 59.69,62.23 60.96,60.96 60.96,49.53 63.5,46.99 63.5,41.3 62.27,40.07 RV2.P$1
N$19
  Top 0.813: IC2.3 49.53,68.58 52.07,66.04 R20.P$1 R29.P$2
N$20
  Bottom 0.813: R15.P$2 3.81,73.66 5.08,74.93 JP1.1
N$21  (via drill 0.51)
  Top 0.813: SJ4.2 1.27,15.24 2.54,13.97 22.86,13.97 24.13,15.24 v29.21,15.24
  Bottom 0.813: IC5.3 36.83,17.78 34.29,15.24 v29.21,15.24
N$22
  Bottom 0.813: IC2.5 26.67,71.12 25.4,69.85 R16.P$1 R5.P$2 22.86,66.04 21.59,64.77 S5.2
N$23  (via drill 0.51)
  Top 0.813: v27.94,54.61 33.02,59.69 33.02,64.77 31.75,66.04 IC2.7
  Bottom 0.813: R15.P$1 3.81,55.88 5.08,54.61 v27.94,54.61
N$25
  Bottom 0.813: S5.1 17.6,68.58 R17.P$2
N$26
  Bottom 0.813: IC5.9 46.99,10.16 48.26,11.43 48.26,16.51 46.99,17.78 IC5.12
N$27
  Top 0.61: S200.3 95.25,59.69 93.25,61.69 VR200.TOP
  Bottom 0.61: Q200.1 92.71,74.93 93.98,73.66 LED200.A 93.98,68.58 93.25,67.85 VR200.TOP
N$28
  Bottom 0.61: LED200.K 96.52,73.66 R200.P$2
N$29  (via drill 0.51)
  Top 0.61: D200.A 88.9,21.59 88.9,46.35 v92.71,50.16
  Bottom 0.61: VR200.WIPER 97.25,62.96 92.71,58.42 v92.71,50.16
N$30
  Bottom 0.61: S200.2 96.52,13.97 99.06,11.43 D201.A
N$31
  Top 0.61: S300.3 105.41,59.69 102.87,62.23 102.87,65.56 VR300.TOP
  Bottom 0.61: Q300.1 102.87,74.93 104.14,73.66 LED300.A 104.14,68.58 103.41,67.85 VR300.TOP
N$32
  Bottom 0.61: LED300.K 106.68,73.66 R300.P$2
N$33  (via drill 0.51)
  Top 0.61: D300.A 99.06,21.59 99.06,46.99 v102.87,50.8
  Bottom 0.61: v102.87,50.8 102.87,58.42 107.41,62.96 VR300.WIPER
N$34
  Bottom 0.61: S300.2 106.68,13.97 109.22,11.43 D301.A
N$35
  Top 0.61: VR400.TOP 113.57,61.69 115.57,59.69 S400.3
  Bottom 0.61: Q400.1 113.03,74.93 114.3,73.66 LED400.A 114.3,68.58 113.57,67.85 VR400.TOP
N$36
  Bottom 0.61: LED400.K 116.84,73.66 R400.P$2
N$37  (via drill 0.51)
  Top 0.61: D400.A 109.22,21.59 109.22,46.99 v113.03,50.8
  Bottom 0.61: VR400.WIPER 117.57,62.96 113.03,58.42 v113.03,50.8
N$38
  Bottom 0.61: S400.2 116.84,13.97 119.38,11.43 D401.A
N$39
  Top 0.61: VR500.TOP 123.73,61.69 125.73,59.69 S500.3
  Bottom 0.61: Q500.1 123.19,74.93 124.46,73.66 LED500.A 124.46,68.58 123.73,67.85 VR500.TOP
N$40
  Bottom 0.61: LED500.K 127,73.66 R500.P$2
N$41  (via drill 0.51)
  Top 0.61: D500.A 119.38,21.59 119.38,46.99 v123.19,50.8
  Bottom 0.61: v123.19,50.8 123.19,58.42 127.73,62.96 VR500.WIPER
N$42
  Bottom 0.61: S500.2 127,13.97 129.54,11.43 D501.A
N$43
  Top 0.61: S600.3 135.89,59.69 133.89,61.69 VR600.TOP
  Bottom 0.61: Q600.1 133.35,74.93 134.62,73.66 LED600.A 134.62,68.58 133.89,67.85 VR600.TOP
N$44
  Bottom 0.61: LED600.K 137.16,73.66 R600.P$2
N$45  (via drill 0.51)
  Top 0.61: D600.A 129.54,21.59 129.54,46.99 v133.35,50.8
  Bottom 0.61: VR600.WIPER 137.89,62.96 133.35,58.42 v133.35,50.8
N$46
  Bottom 0.61: S600.2 137.16,13.97 139.7,11.43 D601.A
N$47
  Top 0.61: VR700.TOP 144.05,61.69 146.05,59.69 S700.3
  Bottom 0.61: Q700.1 143.51,74.93 144.78,73.66 LED700.A 144.78,68.58 144.05,67.85 VR700.TOP
N$48
  Bottom 0.61: LED700.K 147.32,73.66 R700.P$2
N$49  (via drill 0.51)
  Top 0.61: D700.A 139.7,21.59 139.7,46.99 v143.51,50.8
  Bottom 0.61: VR700.WIPER 148.05,62.96 143.51,58.42 v143.51,50.8
N$50
  Bottom 0.61: S700.2 147.32,13.97 149.86,11.43 D701.A
N$51
  Top 0.61: S800.3 156.21,59.69 154.21,61.69 VR800.TOP
  Bottom 0.61: Q800.1 153.67,74.93 154.94,73.66 LED800.A 154.94,68.58 154.21,67.85 VR800.TOP
N$52
  Bottom 0.61: LED800.K 157.48,73.66 R800.P$2
N$53  (via drill 0.51)
  Top 0.61: D800.A 149.86,21.59 149.86,46.99 v153.67,50.8
  Bottom 0.61: VR800.WIPER 158.21,62.96 153.67,58.42 v153.67,50.8
N$54
  Bottom 0.61: S800.2 157.48,13.97 160.02,11.43 D801.A
N$55
  Top 0.61: VR900.TOP 164.37,61.69 166.37,59.69 S900.3
  Bottom 0.61: Q900.1 163.83,74.93 165.1,73.66 LED900.A 165.1,68.58 164.37,67.85 VR900.TOP
N$56
  Bottom 0.61: LED900.K 167.64,73.66 R900.P$2
N$57  (via drill 0.51)
  Top 0.61: D900.A 160.02,21.59 160.02,46.99 v163.83,50.8
  Bottom 0.61: v163.83,50.8 163.83,58.42 168.37,62.96 VR900.WIPER
N$58
  Bottom 0.61: D901.A 170.18,11.43 167.64,13.97 S900.2
N$59
  Top 0.61: S1000.3 176.53,59.69 174.53,61.69 VR1000.TOP
  Bottom 0.61: Q1000.1 173.99,74.93 175.26,73.66 LED1000.A 175.26,68.58 174.53,67.85 VR1000.TOP
N$60
  Bottom 0.61: LED1000.K 177.8,73.66 R1000.P$2
N$61  (via drill 0.51)
  Top 0.61: D1000.A 170.18,21.59 170.18,46.99 v173.99,50.8
  Bottom 0.61: v173.99,50.8 173.99,58.42 178.53,62.96 VR1000.WIPER
N$62
  Bottom 0.61: D1001.A 180.34,11.43 177.8,13.97 S1000.2
N$63
  Bottom 0.813: SJ5.1 40.64,8.89 39.37,10.16 IC5.6 R14.P$2 31.75,10.16 30.61,11.3 C11.2
N$64
  Bottom 0.813: IC4.6 70.23,76.2 R21.P$1 R18.P$1 73.66,78.74 76.2,81.28 R13.P$2 R30.P$1
N$65
  Top 0.813: JP5.1 IC3.6 IC3.7
  Bottom 0.813: JP5.1 44.45,59.69 43.18,60.96 R28.P$2
N$66  (via drill 0.51)
  Top 0.813: v33.02,55.88 37.21,60.07 IC2.1
  Bottom 0.813: R10.P$1 R26.P$1 11.43,57.15 12.7,55.88 v33.02,55.88 | IC2.1 R27.P$1
N$67  (via drill 0.51)
  Top 0.813: v8.89,69.85 8.89,76.2 7.62,77.47 JP4.1
  Bottom 0.813: R26.P$2 v8.89,69.85
N$68
  Top 0.813: R10.P$2 6.35,66.04 1.27,71.12 1.27,78.74 2.54,80.01 JP2.1
N$69
  Bottom 0.813: IC2.6 31.75,68.58 41.91,78.74 48.26,78.74 52.07,82.55 52.07,83.82 54.61,86.36 60.96,86.36 66.04,81.28 IC4.7 69.85,81.28 71.12,82.55 R21.P$2
N$70  (via drill 0.51)
  Top 0.813: v54.61,67.31 54.61,74.93 R23.P$2 | IC4.5 64.77,76.2 v62.23,73.66
  Bottom 0.813: R24.P$1 52.07,67.31 v54.61,67.31 | v62.23,73.66 57.15,73.66 55.88,74.93 R23.P$2
N$71
  Bottom 0.813: S1.2 22.86,78.74 24.13,77.47 D3.A
POTSUM  (via drill 0.51)
  Top 0.61: D1000.C 172.72,7.62 172.09,6.99 162.56,6.99 | 162.56,6.99 152.4,6.99 | 152.4,6.99 142.24,6.99 | 142.24,6.99 132.08,6.99 | 132.08,6.99 121.92,6.99 | 121.92,6.99 111.76,6.99 | 111.76,6.99 101.6,6.99 | 101.6,6.99 91.44,6.99 | 91.44,6.99 81.92,6.99 81.28,7.62 D100.C | D900.C 162.56,6.99 | D800.C 152.4,6.99 | D700.C 142.24,6.99 | D600.C 132.08,6.99 | D500.C 121.92,6.99 | D200.C 91.44,6.99 | D300.C 101.6,6.99 | D400.C 111.76,6.99 | R22.P$1 76.2,53.34 76.2,39.37 77.47,38.1 v77.47,13.97
  Bottom 0.61: D100.C 77.47,12.7 v77.47,13.97
PRECLK  (via drill 0.51)
  Top 0.813: 36.83,39.37 35.56,38.1 v35.56,29.21 | IC1.7 36.83,39.37 | 36.83,39.37 35.56,40.64 35.56,48.26 v33.02,50.8
  Bottom 0.813: v33.02,50.8 R7.P$1 | v35.56,29.21 35.56,27.94 41.91,21.59 41.91,16.51 43.18,15.24 IC5.11
RUN-IN  (via drill 0.51)
  Top 0.305: SJ1.2 2.54,29.21 5.08,29.21
  Top 0.813: R30.P$2 78.74,73.66 76.2,71.12 66.04,71.12 63.5,68.58 v63.5,64.77 | v63.5,55.88 63.5,53.34 55.88,45.72 55.88,41.91 53.34,39.37 46.99,39.37 38.1,30.48 38.1,29.21 36.83,27.94 33.02,27.94 31.75,29.21 v30.48,29.21 30.48,33.91 IC1.4 | 5.08,29.21 v13.97,29.21 S3.A
  Bottom 0.813: v63.5,64.77 v63.5,55.88 | v30.48,29.21 v13.97,29.21
RUN-OUT
  Bottom 0.813: IC5.5 39.37,12.7 40.64,13.97 40.64,19.05 39.37,20.32 IC5.2 31.37,26.67 16.51,26.67 15.24,27.94 SJ1.1
STEP1  (via drill 0.51)
  Top 0.61: Q100.2 85.09,76.2 v80.65,71.75 | JP100.1 v83.19,3.81 | v83.19,15.24 83.19,19.68 80.65,22.23 v80.65,38.1
  Bottom 0.61: v80.65,71.75 v80.65,38.1 | v83.19,3.81 v83.19,15.24 81.28,15.24 78.74,17.78 IC6.3
STEP2  (via drill 0.51)
  Top 0.61: Q200.2 95.25,76.2 v90.81,71.75 | v90.81,41.91 90.81,22.23 93.35,19.68 v93.35,15.24 | JP200.2 89.54,5.71 69.22,5.71 v68.58,6.35
  Bottom 0.61: v90.81,71.75 v90.81,41.91 | v93.35,15.24 93.35,5.71 JP200.2 | v68.58,6.35 68.58,13.97 69.85,15.24 IC6.2
STEP3  (via drill 0.51)
  Top 0.61: Q300.2 105.41,76.2 v100.97,71.75 | v100.97,40.64 100.97,22.23 103.51,19.68 v103.51,15.24 | v88.9,3.81 88.9,1.91 88.27,1.27 68.58,1.27 67.31,2.54 v67.31,5.08 | v91.44,5.71 100.33,5.71 101.6,4.45 JP300.2
  Bottom 0.61: v100.97,71.75 v100.97,40.64 | v103.51,15.24 103.51,5.71 JP300.2 | v88.9,3.81 90.81,5.71 v91.44,5.71 | v67.31,5.08 67.31,19.05 68.58,20.32 IC6.4
STEP4  (via drill 0.51)
  Top 0.61: Q400.2 115.57,76.2 v111.13,71.75 | v111.13,39.37 v111.13,34.29 111.13,22.23 113.67,19.68 v113.67,15.24 | IC6.7 74.93,27.94 76.2,29.21 v76.2,34.29
  Bottom 0.61: v111.13,71.75 v111.13,39.37 | v111.13,34.29 v76.2,34.29 | v113.67,15.24 113.67,5.71 JP400.2
STEP5  (via drill 0.51)
  Top 0.61: Q500.2 125.73,76.2 v121.29,71.75 | v121.29,36.83 121.29,22.23 123.83,19.68 v123.83,15.24
  Bottom 0.61: v121.29,71.75 v121.29,36.83 75.57,36.83 66.68,27.94 IC6.10 | v123.83,15.24 123.83,5.71 JP500.2
STEP6  (via drill 0.51)
  Top 0.61: Q600.2 135.89,76.2 v131.45,71.75 | v133.99,15.24 133.99,19.68 131.45,22.23 v131.45,31.75 | IC6.1 71.12,12.7 69.85,13.97 v69.85,24.13
  Bottom 0.61: v131.45,71.75 v131.45,31.75 81.92,31.75 80.65,33.02 74.3,33.02 69.85,28.57 v69.85,24.13 | v133.99,15.24 133.99,5.71 JP600.2
STEP7  (via drill 0.51)
  Top 0.61: Q700.2 146.05,76.2 v141.61,71.75 | v141.61,30.48 141.61,22.23 144.15,19.68 v144.15,15.24
  Bottom 0.61: v141.61,71.75 v141.61,30.48 82.55,30.48 74.93,22.86 IC6.5 | v144.15,15.24 144.15,5.71 JP700.2
STEP8  (via drill 0.51)
  Top 0.61: Q800.2 156.21,76.2 v151.77,71.75 | v154.31,15.24 154.31,19.68 151.77,22.23 v151.77,29.21 | IC6.6 74.93,25.4 76.2,24.13 v76.2,21.59
  Bottom 0.61: v151.77,71.75 v151.77,29.21 83.82,29.21 v76.2,21.59 | v154.31,15.24 154.31,5.71 JP800.2
STEP9  (via drill 0.51)
  Top 0.61: Q900.2 166.37,76.2 v161.93,71.75 | v161.93,27.94 161.93,22.23 164.47,19.68 v164.47,15.24 | v83.82,27.3 83.82,39.37 82.55,40.64 v79.38,40.64
  Bottom 0.61: v161.93,71.75 v161.93,27.94 85.73,27.94 85.09,27.3 v83.82,27.3 | v164.47,15.24 164.47,5.71 JP900.2 | IC6.9 67.95,30.48 78.11,40.64 v79.38,40.64
STEP10  (via drill 0.51)
  Top 0.61: Q1000.2 176.53,76.2 v172.09,71.75 | v172.09,26.67 172.09,22.23 174.63,19.68 v174.63,15.24 | v86.36,35.56 v86.36,26.67
  Bottom 0.61: v172.09,71.75 v172.09,26.67 v86.36,26.67 | v174.63,15.24 174.63,5.71 JP1000.2 | IC6.11 67.31,25.4 68.58,26.67 68.58,28.57 75.57,35.56 v86.36,35.56
STOP-IN  (via drill 0.51)
  Top 0.305: SJ2.2 2.54,31.75 5.08,31.75
  Top 0.813: 5.08,31.75 19.05,31.75 v25.4,25.4 | v30.48,25.4 39.37,25.4 43.18,21.59 43.18,13.97 44.45,12.7 IC5.10 46.99,12.7 48.26,13.97 48.26,15.24 49.53,16.51 D2.A
  Bottom 0.813: v25.4,25.4 v30.48,25.4
STOP-OUT  (via drill 0.51)
  Top 0.813: v20.32,27.94 17.78,30.48 SJ2.1
  Bottom 0.813: IC5.1 36.83,22.86 31.75,27.94 v20.32,27.94
VBATT
  Top 0.813: BAT1.V+ 45.47,82.8 41.91,86.36 26.67,86.36 25.58,85.27 S1.1
VCC
  Top 0.813: C9.+ 26.67,82.55 21.59,77.47 D3.C
  Bottom 0.61: 97.79,81.28 87.63,81.28 Q100.3 | 97.79,81.28 107.95,81.28 | 107.95,81.28 118.11,81.28 | 118.11,81.28 128.27,81.28 | 128.27,81.28 138.43,81.28 | 138.43,81.28 148.59,81.28 | 148.59,81.28 158.75,81.28 | 158.75,81.28 168.91,81.28 | 168.91,81.28 176.53,81.28 Q1000.3 | Q900.3 168.91,81.28 | Q800.3 158.75,81.28 | Q700.3 148.59,81.28 | Q600.3 138.43,81.28 | Q500.3 128.27,81.28 | Q400.3 118.11,81.28 | Q300.3 107.95,81.28 | Q200.3 97.79,81.28
  Bottom 0.813: 12.7,72.39 12.7,62.23 17.78,57.15 25.4,57.15 | 25.4,57.15 35.56,57.15 | 35.56,57.15 47.63,57.15 | 47.63,57.15 47.63,52.7 49.53,50.8 52.07,50.8 | 52.07,50.8 57.15,50.8 | 25.4,57.15 R16.P$2 25.4,62.23 26.67,63.5 IC2.8 | 52.07,50.8 R20.P$2 R24.P$2 | 82.55,81.28 80.65,79.38 80.65,74.3 72.39,66.04 66.04,66.04 63.5,68.58 50.8,68.58 47.63,65.41 47.63,57.15 | 82.55,81.28 87.63,81.28 | IC4.8 67.69,85.47 68.58,86.36 81.28,86.36 82.55,85.09 82.55,81.28 | IC6.16 53.34,12.7 | 53.34,12.7 53.34,22.86 | 53.34,22.86 53.34,24.13 59.06,29.84 59.06,34.29 | 57.15,50.8 57.15,43.18 59.06,41.27 59.06,34.29 | 57.15,50.8 57.66,50.8 58.04,51.18 IC3.8 | 53.34,22.86 IC5.14 46.1,26.29 45.72,26.67 C5.1 | 53.34,12.7 53.34,5.08 49.53,1.27 26.67,1.27 20.22,7.72 S3.4 20.26,11.43 22.86,11.43 24.13,12.7 C11.1 | C6.1 59.06,34.29 | 35.56,57.15 R7.P$2 35.56,46.99 | IC1.8 38.48,42.8 35.56,45.72 35.56,46.99 | C7.1 35.56,46.99 | JP6.1 12.7,72.39 | D3.C 15.24,77.47 12.7,74.93 12.7,72.39

### Text on the board
Bottom: V10
tPlace: SEQUENCER | ON | OFF | CV1 | POWER | CV2 | GND | 9V | GATE | VCC | SHORT | GND | + | + | + | + | + | + | + | + | + | + | RAW CV OUT | LONG | 10uf | 0.1uf | TEMPO CV IN | + | 10uf | 0.1uf | RATE | SLIDE | CLK / CV IN | TEMPO | I/0 | 10uf | 0.1uf | CLK | STOP | 0.1uf | RUN | BTN | 0.1uf | 1000pf | RUN | 1 | 2 | 3 | 4 | 5 | 6 | 7 | 8 | 9 | 10 | STEP / OUT | ONCE | SEQ. RESET
bPlace: 1000uf | SEQUENCER
tDocu: Byron Jacquot